# Altium schematic sheet pwm_buffers_fault_sig.SchDoc
size A4; SheetNumber: 2; SheetTotal: 11; SPICEModelCacheDVQRIBGN: <root> / <DocumentId>DVQRIBGN</DocumentId> / <CacheFrame Number="0"> / <Model Name="3mm_151031ss04000" Kind="CKT"> / <Text>************************************************** / * Manufacturer:           Wurth Elektronik / * Kinds:                  THT Mono-color Round Color / * Matchcode:              WL-TMRC / * Library Type:           LTspice / * Version:                rev22a / * Created/modified by:    Ella / * Date and Time:          2022-02-23 / * Team:                   eiSos EDA Service / * Contact:                libraries@we-online.com / ************************************************** / * Copyright(C) 2022 WÃ¼rth Elektronik eiSos GmbH &amp; Co. KG / * All Rights Reserved. / ************************************************** / * Disclaimer: While WÃ¼rth Elektronik eiSos has made every reasonable effort to ensure the accuracy / * of the simulation models provided, WÃ¼rth Elektronik eiSos does not guarantee the exemption of error on / * the simulation models, nor does WÃ¼rth Elektronik eiSos guarantee that the simulation model is current. / * WÃ¼rth Elektronik eiSos reserves the right to make any adjustments at any time without notice. / * WÃ¼rth Elektronik eiSos expressly disclaims all implied warranties regarding this simulation model. / ************************************************** / .subckt 3mm_151031SS04000  1  2 / D1 1 2 TMRC / .MODEL TMRC D / + IS=10.010E-21 / + N=1.8860 / + RS=1.0000E-6 / + IKF=1.0000E3 / + CJO=1.0000E-12 / + M=.3333 / + VJ=.75 / + BV=5 / + IBV=10.00E-6 / + TT=5.0000E-9 / .ends</Text> / </Model> / </CacheFrame> / </root>
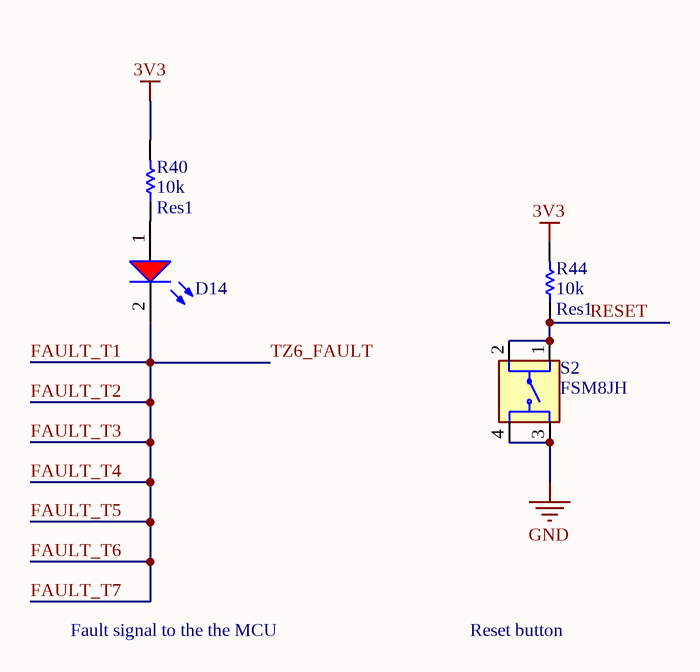
[diagram p0: pwm_buffers_fault_sig.SchDoc]

## Parts
D14  Super Red, 2V, 40°  [WL-TMRC_D3.95H5.3]  (value not drawn)
R40  Res1  value 10k  [AXIAL-0.4]
R44  Res1  value 10k  [AXIAL-0.4]
S2  FSM8JH  [SW_FSM8JH]

## Nets
3V3: R40.2 R44.2
GND: S2.3 S2.4
FAULT_T1: D14.2(K)  [also labelled FAULT_T2, FAULT_T3, FAULT_T4, FAULT_T5, FAULT_T6, FAULT_T7, TZ6_FAULT]
RESET: R44.1 S2.1 S2.2
NetD14_1: D14.1(A) R40.1

## Notes on the sheet
- Fault signal to the the MCU
- Reset button

## Library data of the parts
D14 = 151031SS04000: WL-TMRC Mono-color Round Color, THT, D3.95 x H5.3mm, Super Red, 2V, 40°; Manufacturer: Wurth Elektronik; Case/Size Code: 3mm; Chip Technology: AlInGaP; Dominant Wavelength: 635nm; Luminous Intensity: 160mcd; Peak Wavelength: 640nm; Manufacturer Part Number: 151031SS04000; Category: Signal LEDs; Match Code: WL-TMRC; ComponentLink1Description: Website Link; ComponentLink1URL: https://www.we-online.com/redexpert/article/151031SS04000?ad; ComponentLink2Description: Datasheet Link; ComponentLink2URL: https://www.we-online.com/redexpert/spec/151031SS04000?ad; Mount: Through Hole; Operating Temperature Max: 85°C; Operating Temperature Min: -40°C; Packaging: Bulk; Height: 5.3mm; Diameter: 3.95mm; Emitting Color: Super Red; Forward Voltage: 2V; Viewing Angle: 40°
R40 R44 = Res1: Resistor; Published: 8-Jun-2000; LatestRevisionDate: 17-Jul-2002; LatestRevisionNote: Re-released for DXP Platform.; PackageReference: AXIAL-0.3; Publisher: Altium Limited; PackageDescription: Axial Device, Thru-Hole; 2 Leads; 0.3 in Pin Spacing
S2 = FSM8JH: Tactile Switch SPST-NO Top Actuated Through Hole; MF: TE Connectivity; Check_prices: https://www.snapeda.com/parts/FSM8JH/TE+Connectivity+ALCOSWITCH+Switches/view-part/?ref=eda; Value: *; Availability: In Stock; MP: FSM8JH; Price: None; Package: None; SnapEDA_Link: https://www.snapeda.com/parts/FSM8JH/TE+Connectivity+ALCOSWITCH+Switches/view-part/?ref=snap